# EAGLE design InfoAmazonia (EAGLE 7.3.0)
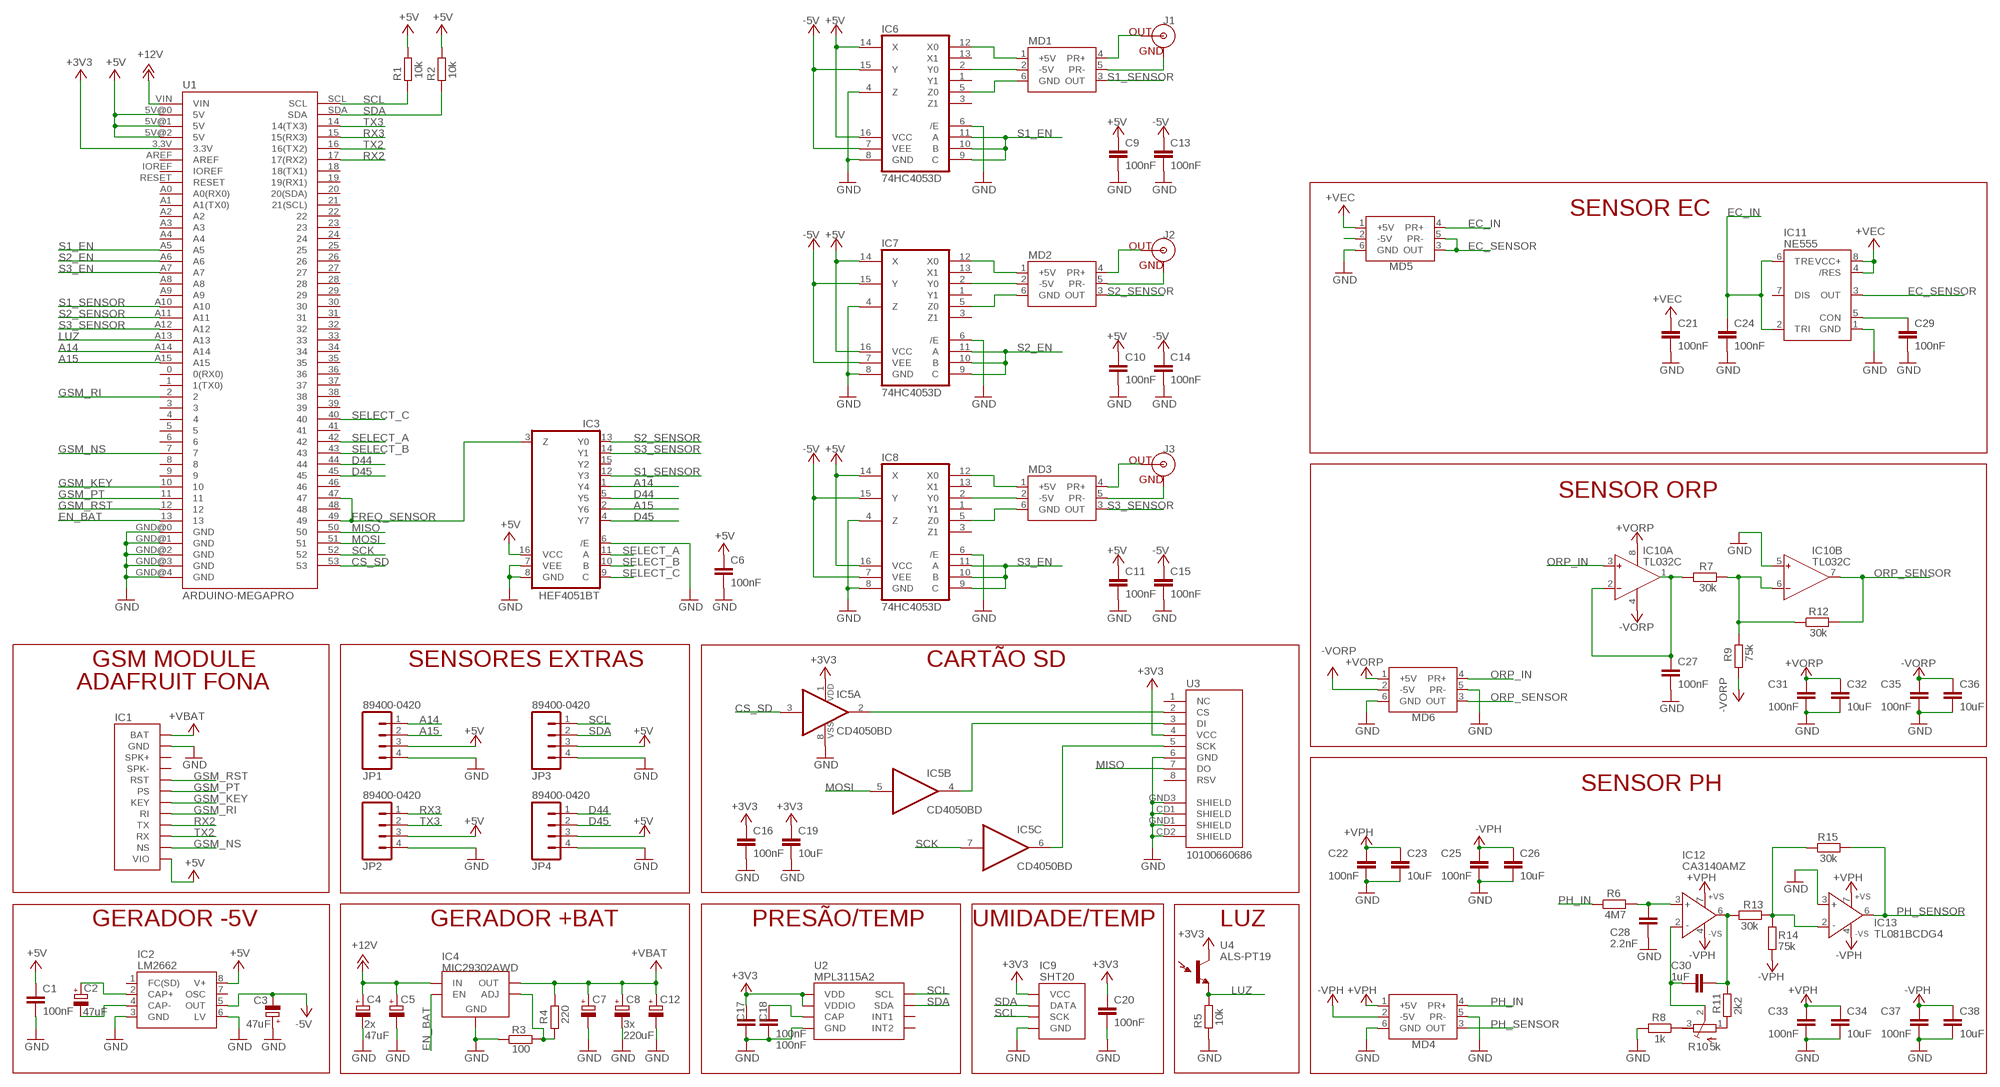
[diagram p0: schematic, sheet 1]

## Parts
C1  100nF  C-EUC0603  [C0603]
C2  47uF  CPOL-EUSMC_B  [SMC_B]
C3  47uF  CPOL-EUSMC_B  [SMC_B]
C4  47uF  CPOL-EUUD6,3-5,8  [UD-6,3X5,8_NICHICON]
C5  47uF  CPOL-EUUD6,3-5,8  [UD-6,3X5,8_NICHICON]
C6  100nF  C-EUC0603  [C0603]
C7  220uF  CPOL-EUUD6,3-5,8  [UD-6,3X5,8_NICHICON]
C8  220uF  CPOL-EUUD6,3-5,8  [UD-6,3X5,8_NICHICON]
C9  100nF  C-EUC0603  [C0603]
C10  100nF  C-EUC0603  [C0603]
C11  100nF  C-EUC0603  [C0603]
C12  220uF  CPOL-EUUD6,3-5,8  [UD-6,3X5,8_NICHICON]
C13  100nF  C-EUC0603  [C0603]
C14  100nF  C-EUC0603  [C0603]
C15  100nF  C-EUC0603  [C0603]
C16  100nF  C-EUC0603  [C0603]
C17  100nF  C-EUC0603  [C0603]
C18  100nF  C-EUC0603  [C0603]
C19  10uF  C-EUC0603  [C0603]
C20  100nF  C-EUC0603  [C0603]
C21  100nF  C-EUC0603  [C0603]
C22  100nF  C-EUC0603  [C0603]
C23  10uF  C-EUC0603  [C0603]
C24  100nF  C-EUC0603  [C0603]
C25  100nF  C-EUC0603  [C0603]
C26  10uF  C-EUC0603  [C0603]
C27  100nF  C-EUC0603  [C0603]
C28  2.2nF  C-EUC0603  [C0603]
C29  100nF  C-EUC0603  [C0603]
C30  1uF  C-EUC0603  [C0603]
C31  100nF  C-EUC0603  [C0603]
C32  10uF  C-EUC0603  [C0603]
C33  100nF  C-EUC0603  [C0603]
C34  10uF  C-EUC0603  [C0603]
C35  100nF  C-EUC0603  [C0603]
C36  10uF  C-EUC0603  [C0603]
C37  100nF  C-EUC0603  [C0603]
C38  10uF  C-EUC0603  [C0603]
IC1  ADAFRUIT FONA  ADAFRUIT_FONA  [ADAFRUIT_FONA]
IC2  LM2662  [SO8]
IC3  HEF4051BT  4051D  [SO16]
IC4  MIC29302AWD  MIC29XXX  [TO252-5]
IC5  CD4050BD  4050D  [SO16]
IC6  74HC4053D  4053D  [SO16]
IC7  74HC4053D  4053D  [SO16]
IC8  74HC4053D  4053D  [SO16]
IC9  SHT20  SHT2X  [SHT2X]
IC10  TL032C  AMPOP_2R  [SO8]
IC11  NE555  [SO8]
IC12  CA3140AMZ  AMPOP  [SO8]
IC13  TL081BCDG4  AMPOP  [SO8]
J1  31-5431-10RFX  BNCPTH  [BNC]
J2  31-5431-10RFX  BNCPTH  [BNC]
J3  31-5431-10RFX  BNCPTH  [BNC]
JP1  89400-0420  M04JST-PTH-VERT  [JST-4-PTH-VERT]
JP2  89400-0420  M04JST-PTH-VERT  [JST-4-PTH-VERT]
JP3  89400-0420  M04JST-PTH-VERT  [JST-4-PTH-VERT]
JP4  89400-0420  M04JST-PTH-VERT  [JST-4-PTH-VERT]
MD1  INFO-AMAZONIA-MODULE  [INFO-AMAZONIA-MODULE]
MD2  INFO-AMAZONIA-MODULE  [INFO-AMAZONIA-MODULE]
MD3  INFO-AMAZONIA-MODULE  [INFO-AMAZONIA-MODULE]
MD4  INFO-AMAZONIA-MODULE  [INFO-AMAZONIA-MODULE]
MD5  INFO-AMAZONIA-MODULE  [INFO-AMAZONIA-MODULE]
MD6  INFO-AMAZONIA-MODULE  [INFO-AMAZONIA-MODULE]
R1  10k  R-EU_R0603  [R0603]
R2  10k  R-EU_R0603  [R0603]
R3  100  R-EU_R0603  [R0603]
R4  220  R-EU_R0603  [R0603]
R5  10k  R-EU_R0603  [R0603]
R6  4M7  R-EU_R0603  [R0603]
R7  30k  R-EU_R0603  [R0603]
R8  1k  R-EU_R0603  [R0603]
R9  75k  R-EU_R0603  [R0603]
R10  5k  RTRIM329W  [RTRIM3296W]
R11  2k2  R-EU_R0603  [R0603]
R12  30k  R-EU_R0603  [R0603]
R13  30k  R-EU_R0603  [R0603]
R14  75k  R-EU_R0603  [R0603]
R15  30k  R-EU_R0603  [R0603]
U1  ARDUINO-MEGAPRO  [ARDUINO_MEGA_2560]
U2  MPL3115A2  MPL3115A2LGA8  [LGA8]
U3  10100660686  USD-SOCKETNEW  [MICRO-SD-SOCKET-PP]
U4  ALS-PT19  LIGHTSENSORALS  [ALS-PT19]

## Nets
+3V3: C16.1 C17.1 C19.1 C20.1 IC5.1(P:VDD) IC9.5(VCC) U1.3.3V U2.1(VDD) U2.4(VDDIO) U3.4(VCC) U4.C(C1)
+5V: C1.1 C6.1 C9.1 C10.1 C11.1 IC1.12(VIO) IC2.8(V+) IC3.16(VCC) IC6.14(X) IC6.16(VCC) IC7.14(X) IC7.16(VCC) IC8.14(X) IC8.16(VCC) JP1.3 JP2.3 JP3.3 JP4.3 R1.2 R2.2 U1.5V@0(5V) U1.5V@1(5V) U1.5V@2(5V)
+12V: C4.+ C5.+ IC4.2(IN) U1.VIN
+VBAT: C7.+ C8.+ C12.+ IC1.1(BAT) IC4.4(OUT) R4.1
+VEC: C21.1 IC11.4(/RES) IC11.8(VCC+) MD5.1(+5V)
+VORP: C31.1 C32.1 IC10.8(P:V+) MD6.1(+5V)
+VPH: C22.1 C23.1 C33.1 C34.1 IC12.7(+VS) IC13.7(+VS) MD4.1(+5V)
-5V: C3.- C13.1 C14.1 C15.1 IC2.5(OUT) IC6.7(VEE) IC6.15(Y) IC7.7(VEE) IC7.15(Y) IC8.7(VEE) IC8.15(Y)
-VORP: C35.1 C36.1 IC10.4(P:V-) MD6.2(-5V) R9.2
-VPH: C25.1 C26.1 C37.1 C38.1 IC12.4(-VS) IC13.4(-VS) MD4.2(-5V) R14.2
A14: IC3.1(Y4) JP1.1 U1.A14
A15: IC3.2(Y6) JP1.2 U1.A15
CS_SD: IC5.3(A:I) U1.53
D44: IC3.5(Y5) JP4.1 U1.44
D45: IC3.4(Y7) JP4.2 U1.45
EC_IN: C24.1 IC11.2(TRI) IC11.6(TRE) MD5.4(PR+)
EC_SENSOR: IC11.3(OUT) MD5.3(OUT) MD5.5(PR-)
EN_BAT: IC4.1(EN) U1.13
FREQ_SENSOR: IC3.3(Z) U1.47 U1.49
GND: C1.2 C3.+ C4.- C5.- C6.2 C7.- C8.- C9.2 C10.2 C11.2 C12.- C13.2 C14.2 C15.2 C16.2 C17.2 C18.2 C19.2 C20.2 C21.2 C22.2 C23.2 C24.2 C25.2 C26.2 C27.2 C28.2 C29.2 C31.2 C32.2 C33.2 C34.2 C35.2 C36.2 C37.2 C38.2 IC1.2(GND) IC1.K1(GND) IC1.K2(GND) IC2.3(GND) IC2.6(LV) IC3.6(/E) IC3.7(VEE) IC3.8(GND) IC4.3(GND) IC4.6(GND) IC5.8(P:VSS) IC6.4(Z) IC6.6(/E) IC6.8(GND) IC7.4(Z) IC7.6(/E) IC7.8(GND) IC8.4(Z) IC8.6(/E) IC8.8(GND) IC9.2(GND) IC9.7(GND) IC10.5(B:IN+) IC11.1(GND) IC13.3(IN+) JP1.4 JP2.4 JP3.4 JP4.4 MD4.5(PR-) MD4.6(GND) MD5.6(GND) MD6.5(PR-) MD6.6(GND) R3.1 R5.1 R8.2 U1.GND@0(GND) U1.GND@1(GND) U1.GND@2(GND) U1.GND@3(GND) U1.GND@4(GND) U2.3(GND) U3.6(GND) U3.CD1(SHIELD) U3.CD2(SHIELD) U3.GND1(SHIELD) U3.GND3(SHIELD)
GSM_KEY: IC1.7(KEY) U1.10
GSM_NS: IC1.11(NS) U1.7
GSM_PT: IC1.6(PS) U1.11
GSM_RI: IC1.8(RI) U1.2
GSM_RST: IC1.5(RST) U1.12
LUZ: R5.2 U1.A13 U4.E(E1)
MISO: U1.50 U3.7(DO)
MOSI: IC5.5(B:I) U1.51
N$1: J1.GND MD1.5(PR-)
N$2: C28.1 IC12.3(IN+) R6.2
N$3: C30.1 IC12.2(IN-) R10.2(S)
N$4: C30.2 IC12.6(OUT) R11.2 R13.2
N$5: IC13.2(IN-) R13.1 R14.1 R15.1
N$6: R8.1 R10.3(E)
N$7: C18.1 U2.2(CAP)
N$8: R10.1(A) R11.1
N$9: J1.S(OUT) MD1.4(PR+)
N$10: C29.1 IC11.5(CON)
N$11: J2.GND MD2.5(PR-)
N$12: J2.S(OUT) MD2.4(PR+)
N$13: J3.GND MD3.5(PR-)
N$14: C2.- IC2.4(CAP-)
N$15: C27.1 IC10.1(A:OUT) IC10.2(A:IN-) R7.2
N$16: C2.+ IC2.2(CAP+)
N$17: IC10.6(B:IN-) R7.1 R9.1 R12.1
N$18: IC4.5(ADJ) R3.2 R4.2
N$19: IC5.6(C:O) U3.5(SCK)
N$20: IC5.4(B:O) U3.3(DI)
N$21: IC5.2(A:O) U3.2(CS)
N$22: J3.S(OUT) MD3.4(PR+)
N$23: MD5.2(-5V)
N$24: IC6.12(X0) MD1.1(+5V)
N$25: IC6.2(Y0) MD1.2(-5V)
N$26: IC6.5(Z0) MD1.6(GND)
N$27: IC7.5(Z0) MD2.6(GND)
N$28: IC7.2(Y0) MD2.2(-5V)
N$29: IC7.12(X0) MD2.1(+5V)
N$30: IC8.12(X0) MD3.1(+5V)
N$31: IC8.2(Y0) MD3.2(-5V)
N$32: IC8.5(Z0) MD3.6(GND)
ORP_IN: IC10.3(A:IN+) MD6.4(PR+)
ORP_SENSOR: IC10.7(B:OUT) MD6.3(OUT) R12.2
PH_IN: MD4.4(PR+) R6.1
PH_SENSOR: IC13.6(OUT) MD4.3(OUT) R15.2
RX2: IC1.9(TX) U1.17(17(RX2))
RX3: JP2.1 U1.15(15(RX3))
S1_EN: IC6.9(C) IC6.10(B) IC6.11(A) U1.A5
S1_SENSOR: IC3.12(Y3) MD1.3(OUT) U1.A10
S2_EN: IC7.9(C) IC7.10(B) IC7.11(A) U1.A6
S2_SENSOR: IC3.13(Y0) MD2.3(OUT) U1.A11
S3_EN: IC8.9(C) IC8.10(B) IC8.11(A) U1.A7
S3_SENSOR: IC3.14(Y1) MD3.3(OUT) U1.A12
SCK: IC5.7(C:I) U1.52
SCL: IC9.6(SCK) JP3.1 R1.1 U1.SCL U2.8(SCL)
SDA: IC9.1(DATA) JP3.2 R2.1 U1.SDA U2.7(SDA)
SELECT_A: IC3.11(A) U1.42
SELECT_B: IC3.10(B) U1.43
SELECT_C: IC3.9(C) U1.40
TX2: IC1.10(RX) U1.16(16(TX2))
TX3: JP2.2 U1.14(14(TX3))
Unconnected: IC1.3(SPK+) IC1.4(SPK-) IC2.7(OSC) IC3.15(Y2) IC5.9(D:I) IC5.10(D:O) IC5.11(E:I) IC5.12(E:O) IC5.14(F:I) IC5.15(F:O) IC6.1(Y1) IC6.3(Z1) IC6.13(X1) IC7.1(Y1) IC7.3(Z1) IC7.13(X1) IC8.1(Y1) IC8.3(Z1) IC8.13(X1) IC11.7(DIS) U1.0(0(RX0)) U1.1(1(TX0)) U1.3 U1.4 U1.5 U1.6 U1.8 U1.9 U1.18(18(TX1)) U1.19(19(RX1)) U1.20(20(SDA)) U1.21(21(SCL)) U1.22 U1.23 U1.24 U1.25 U1.26 U1.27 U1.28 U1.29 U1.30 U1.31 U1.32 U1.33 U1.34 U1.35 U1.36 U1.37 U1.38 U1.39 U1.41 U1.46 U1.48 U1.A0(A0(RX0)) U1.A1(A1(TX0)) U1.A2 U1.A3 U1.A4 U1.A8 U1.A9 U1.AREF U1.IOREF U1.RESET U2.5(INT2) U2.6(INT1) U3.1(NC) U3.8(RSV)

## Notes on the sheet
- SENSOR EC
- SENSOR ORP
- GSM MODULE | SENSORES EXTRAS | CARTÃO SD
- ADAFRUIT FONA
- SENSOR PH
- GERADOR -5V | GERADOR +BAT | PRESÃO/TEMP | UMIDADE/TEMP | LUZ
- 2x | 3x

## Power pins joined to a net without a drawn wire
FC(SD): IC2.1(FC(SD))

## Library data of the parts
C1 C6 C9-C11 C13-C38 = InfoAmazonia:C-EU: CAPACITOR, European symbol
C2-C5 C7 C8 C12 = InfoAmazonia:CPOL-EU: POLARIZED CAPACITOR, European symbol
IC1 = InfoAmazonia:ADAFRUIT_FONA
IC2 = InfoAmazonia:LM2662
IC3 = InfoAmazonia:4051: 8-channel ANALOG MULTIPLEXER
IC4 = InfoAmazonia:MIC29XXX
IC5 = InfoAmazonia:4050: Hex non-inverting BUFFER
IC6-IC8 = InfoAmazonia:4053: Triple 2-channel ANALOG MULTIPLEXER
IC9 = InfoAmazonia:SHT2X
IC10 = InfoAmazonia:AMPOP_2: Dual Precision, Low Cost, High Speed BiFET Op Amp Source: http://www.analog.com/static/imported-files/data_sheets/AD712.pdf; MF: ALTERA CORPORATION; MPN: AD712KRZ; OC_FARNELL: 1263975; OC_NEWARK: 59K4556
IC11 = InfoAmazonia:NE555: General purpose bipolar Timer
IC12 IC13 = InfoAmazonia:AMPOP: High Performance Video Op Amp Source: http://www.analog.com/static/imported-files/data_sheets/AD811.pdf; MF: ALTERA CORPORATION; MPN: AD811JRZ; OC_FARNELL: 9426485; OC_NEWARK: 82H2980
J1-J3 = InfoAmazonia:BNC: BNC Connector, Mouser Part# 5227161
JP1-JP4 = InfoAmazonia:M04: Header 4 Standard 4-pin 0.1" header. Use with straight break away headers (SKU : PRT-00116), right angle break away headers (PRT-00553), swiss pins (PRT-00743), machine pins (PRT-00117), and female headers (PRT-00115). Molex polarized connector foot print use with SKU : PRT-08231 with associated crimp pins and housings. 1MM SMD Version SKU: PRT-10208
MD1-MD6 = InfoAmazonia:INFO-AMAZONIA-MODULE
R1-R9 R11-R15 = InfoAmazonia:R-EU_: RESISTOR, European symbol
R10 = InfoAmazonia:RTRIM329: Trimm resistor
U1 = InfoAmazonia:ARDUINO-MEGA: Arduino Mega board footprint
U2 = InfoAmazonia:MPL3115A2: Altimeter/Pressure Sensor, I2C, 1.95V-3.6V supply, 50 to 110kPa; PROD_ID: IC-10869
U3 = InfoAmazonia:USD-SOCKET: microSD Socket Push-push type uSD socket. Schematic element and footprint production proven. Spark Fun Electronics SKU : PRT-00127. tDoc lines correctly indicate media card edge positions when inserting (unlocked, locked, depressed).
U4 = InfoAmazonia:LIGHTSENSOR: Ambient Light Sensor Simple light detection sensor. Output varies with light intensity input. Spark Fun Electronics SKU : COM-08348; PROD_ID: IC-11836

## Board
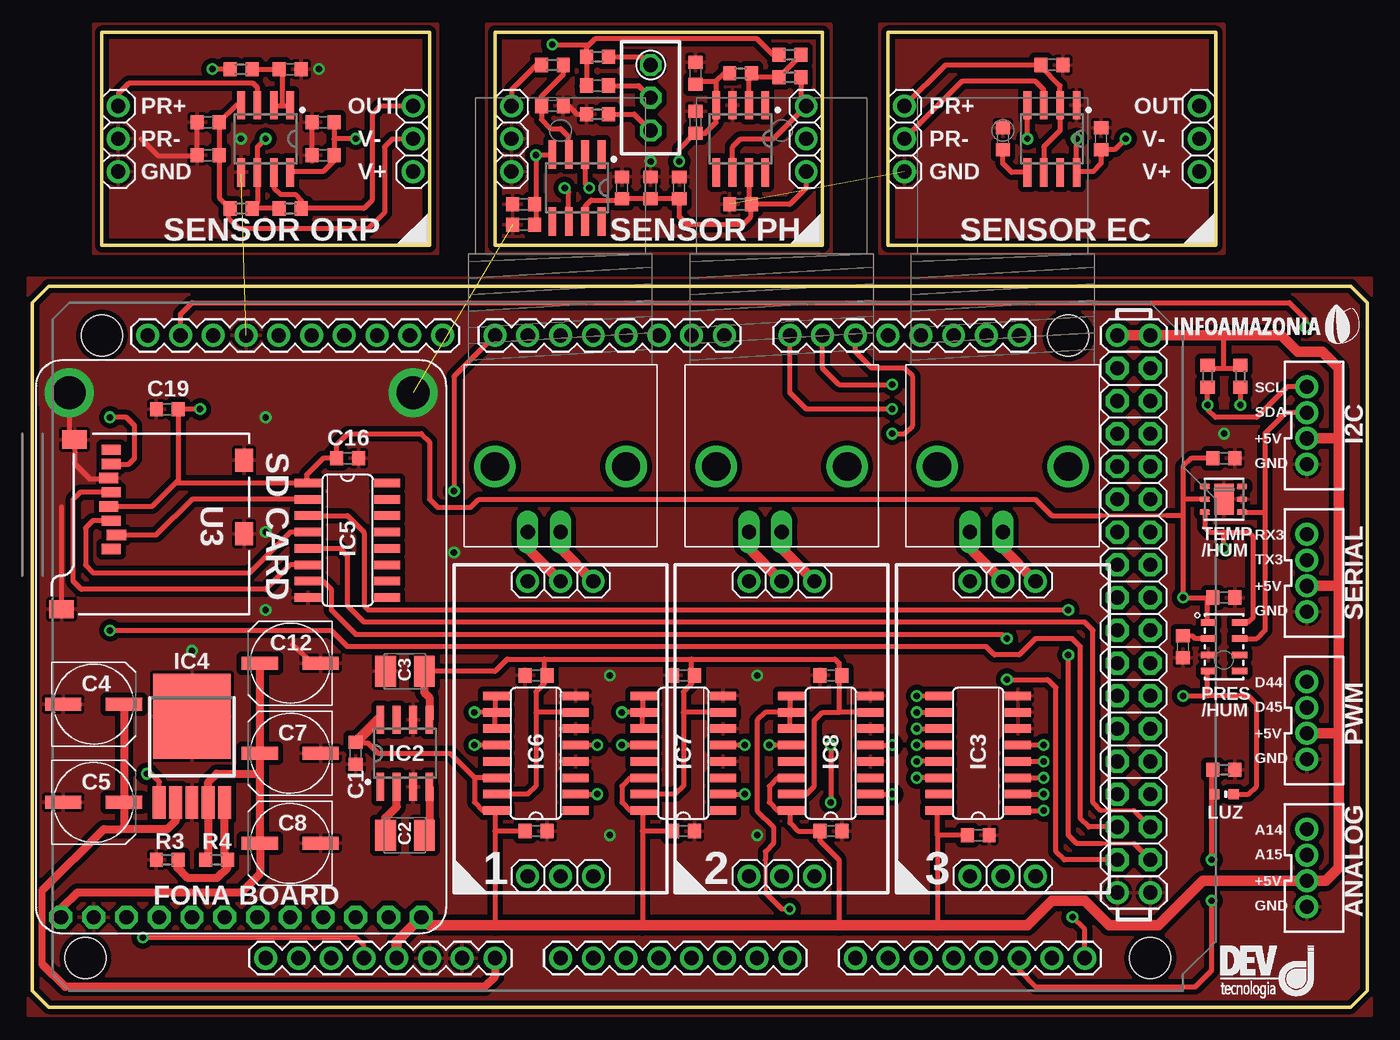
[diagram p1: board, top side]
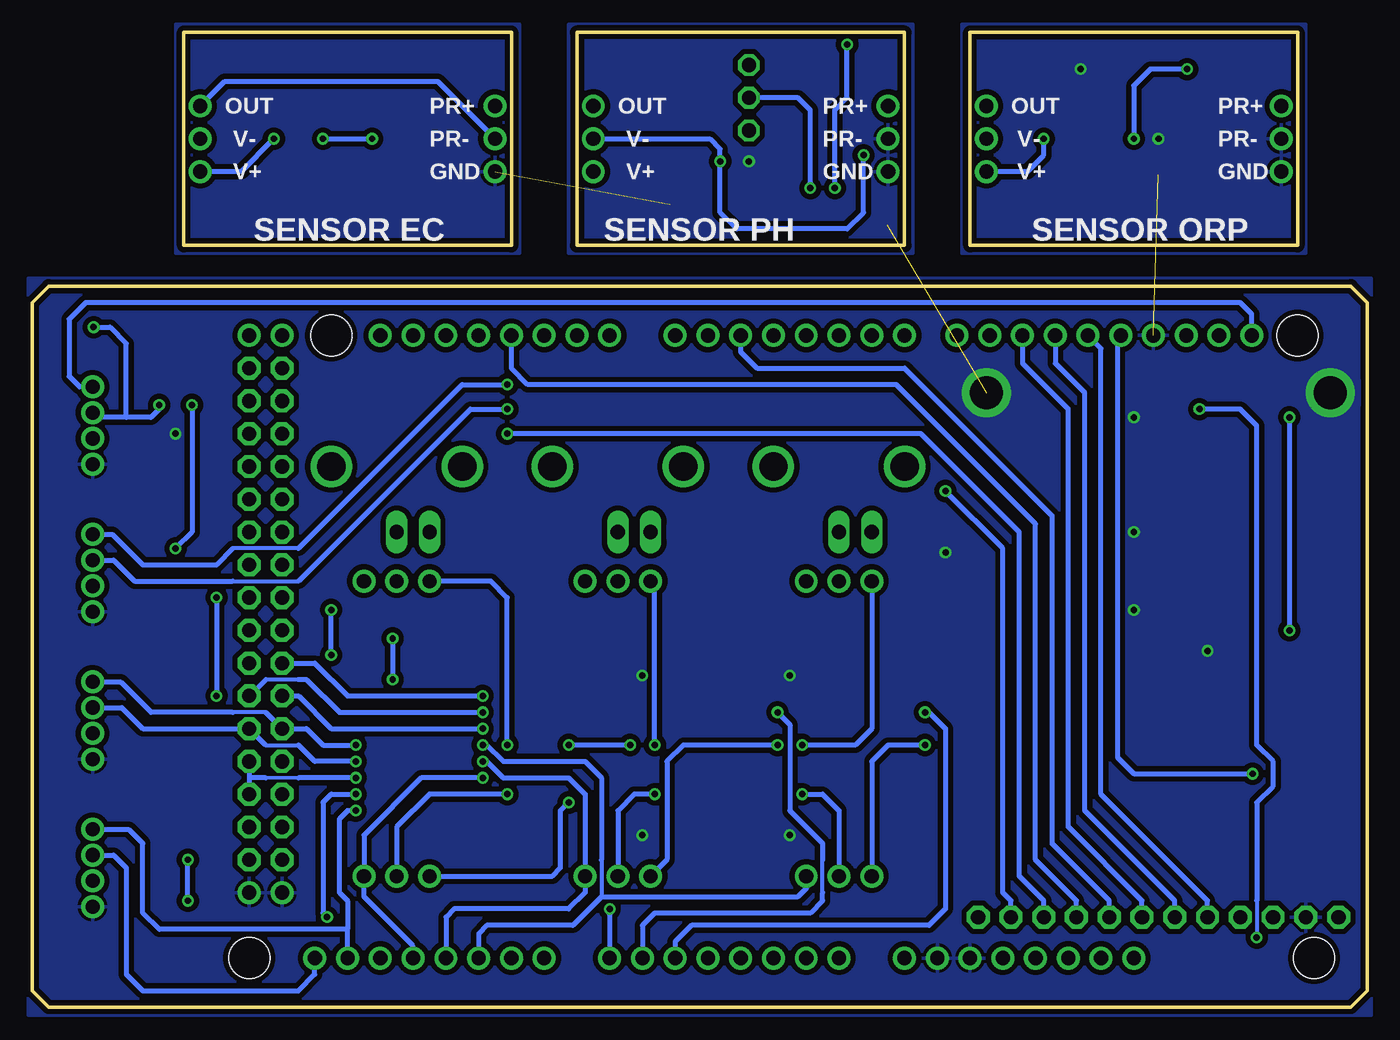
[diagram p2: board, bottom side, seen from below]

Size 103.5 x 75.56 mm. Coordinates in mm from the lower left corner, seen from the top.
Outline: 5.4,59.05 30.8,59.05 30.8,75.56 5.4,75.56 5.4,59.05
Outline: 61.28,59.05 35.88,59.05 35.88,75.56 61.28,75.56 61.28,59.05
Outline: 66.36,59.05 91.76,59.05 91.76,75.56 66.36,75.56 66.36,59.05
Outline: 0,54.61 0,1.27 1.27,0 102.24,0 103.51,1.27 103.51,54.61 102.24,55.88 1.27,55.88 0,54.61
Copper layers (1*16): Top 0.035mm / dielectric 1.5mm / Bottom 0.035mm
Design rules "default *": minimum track width 8mil, minimum drill 0.4mm, track to track 8mil, track to pad 8mil, pad to pad 8mil, via to via 8mil, smd to smd 8mil, copper to edge 5mil, drill to drill 8mil, minimum pad ring 10mil, minimum via ring 8mil, stop-mask expansion 4mil, vias tented up to drill 20mil, thermal gap 10mil

### Footprints (pad centres in the part's own frame; a part is rotated, then mirrored left to right if it is on the bottom)
C0603 = smd 1 x 1.1: 1 -0.85,0; 2 0.85,0
SMC_B = smd 1.6 x 2.4: + -1.5,0; - 1.5,0
UD-6,3X5,8_NICHICON = smd 2.8 x 1: + 2.35,0; - -2.35,0
ADAFRUIT_FONA = drill 1.1 pad 1.778 octagon: 1 -13.97,1.27; 2 -11.43,1.27; 3 -8.89,1.27; 4 -6.35,1.27; 5 -3.81,1.27; 6 -1.27,1.27; 7 1.27,1.27; 8 3.81,1.27; 9 6.35,1.27; 10 8.89,1.27; 11 11.43,1.27; 12 13.97,1.27 | drill 2.54 pad 3.81: K1 -13.335,41.91; K2 13.335,41.91
SO8 = smd 0.6 x 2.2: 1 -1.905,-2.6; 2 -0.635,-2.6; 3 0.635,-2.6; 4 1.905,-2.6; 5 1.905,2.6; 6 0.635,2.6; 7 -0.635,2.6; 8 -1.905,2.6
SO16 = smd 0.66 x 2.032: 1 -4.445,-3.073; 2 -3.175,-3.073; 3 -1.905,-3.073; 4 -0.635,-3.073; 5 0.635,-3.073; 6 1.905,-3.073; 7 3.175,-3.073; 8 4.445,-3.073; 9 4.445,3.073; 10 3.175,3.073; 11 1.905,3.073; 12 0.635,3.073; 13 -0.635,3.073; 14 -1.905,3.073; 15 -3.175,3.073; 16 -4.445,3.073
TO252-5 = smd 1 x 2.5: 1 -2.54,-6.35; 2 -1.27,-6.35; 3 0,-6.35; 4 1.27,-6.35; 5 2.54,-6.35 | smd 6 x 6.6: 6 0,0.318
SHT2X = smd 0.4 x 0.8: 1 -1,-1.4; 2 0,-1.4; 3 1,-1.4; 4 1,1.5; 5 0,1.5; 6 -1,1.5 | smd 2.4 x 1.5: 7 0,0
BNC = drill 2.2: 3 -5.08,5.08; 4 5.08,5.08 | drill 1.1 long: GND -2.54,0; S 0,0
JST-4-PTH-VERT = drill 1.1 pad 1.778: 1 -3,-0.55; 2 -1,-0.55; 3 1,-0.55; 4 3,-0.55
INFO-AMAZONIA-MODULE = drill 1.1 pad 1.778: 1 11.43,-2.54; 2 11.43,0; 3 11.43,2.54; 4 -11.43,2.54; 5 -11.43,0; 6 -11.43,-2.54
R0603 = smd 1 x 1.1: 1 -0.85,0; 2 0.85,0
RTRIM3296W = drill 1.1 pad 1.676 octagon: 1 0,-2.54; 2 0,0; 3 0,2.54
ARDUINO_MEGA_2560 = drill 1.1 pad 1.778: 0 52.07,50.8; 1 49.53,50.8; 2 46.99,50.8; 3 44.45,50.8; 3.3V 24.13,2.54; 4 41.91,50.8; 5 39.37,50.8; 5V@0 26.67,2.54; 5V@1 82.55,50.8; 5V@2 85.09,50.8; 6 36.83,50.8; 7 34.29,50.8; 8 30.226,50.8; 9 27.686,50.8; 10 25.146,50.8; 11 22.606,50.8; 12 20.066,50.8; 13 17.526,50.8; 14 57.15,50.8; 15 59.69,50.8; 16 62.23,50.8; 17 64.77,50.8; 18 67.31,50.8; 19 69.85,50.8; 20 72.39,50.8; 21 74.93,50.8; A0 39.37,2.54; A1 41.91,2.54; A2 44.45,2.54; A3 46.99,2.54; A4 49.53,2.54; A5 52.07,2.54; A6 54.61,2.54; A7 57.15,2.54; A8 62.23,2.54; A9 64.77,2.54; A10 67.31,2.54; A11 69.85,2.54; A12 72.39,2.54; A13 74.93,2.54; A14 77.47,2.54; A15 80.01,2.54; AREF 12.446,50.8; GND@0 29.21,2.54; GND@1 31.75,2.54; GND@2 82.55,7.62; GND@3 85.09,7.62; GND@4 14.986,50.8; IOREF 19.05,2.54; NC 16.51,2.54; RESET 21.59,2.54; SCL 7.366,50.8; SDA 9.906,50.8; VIN 34.29,2.54 | drill 1.1 pad 1.778 octagon: 22 82.55,48.26; 23 85.09,48.26; 24 82.55,45.72; 25 85.09,45.72; 26 82.55,43.18; 27 85.09,43.18; 28 82.55,40.64; 29 85.09,40.64; 30 82.55,38.1; 31 85.09,38.1; 32 82.55,35.56; 33 85.09,35.56; 34 82.55,33.02; 35 85.09,33.02; 36 82.55,30.48; 37 85.09,30.48; 38 82.55,27.94; 39 85.09,27.94; 40 82.55,25.4; 41 85.09,25.4; 42 82.55,22.86; 43 85.09,22.86; 44 82.55,20.32; 45 85.09,20.32; 46 82.55,17.78; 47 85.09,17.78; 48 82.55,15.24; 49 85.09,15.24; 50 82.55,12.7; 51 85.09,12.7; 52 82.55,10.16; 53 85.09,10.16 | hole 3.2: 3.81,50.8; 2.54,2.54; 78.74,50.8; 85.09,2.54
LGA8 = smd 1.2 x 0.5: 1 -1.2,1.875; 2 -1.2,0.625; 3 -1.2,-0.625; 4 -1.2,-1.875; 5 1.2,-1.875; 6 1.2,-0.625; 7 1.2,0.625; 8 1.2,1.875
MICRO-SD-SOCKET-PP = smd 0.8 x 1.5: 1 -8.94,10.7; 2 -7.84,10.3; 3 -6.74,10.7; 4 -5.64,10.9; 5 -4.54,10.7; 6 -3.44,10.9; 7 -2.34,10.7; 8 -1.24,10.7 | smd 1.8 x 1.4: CD1 -2.05,0.4; CD2 -7.75,0.4 | smd 1.4 x 1.9: GND1 -13.6,14.55; GND3 -0.45,13.55
ALS-PT19 = smd 0.8 x 0.8: C -0.75,0; E 0.75,0

### Placement (x,y rotation side)
C1  25.08,19.68 270 top
C2  28.89,13.33 0 top
C3  28.89,26.04 0 top
C4  4.76,23.5 0 top
C5  4.76,15.88 0 top
C6  73.34,13.33 0 top
C7  20,19.68 180 top
C8  20,12.7 180 top
C9  39.05,13.65 0 top
C10  50.48,13.65 0 top
C11  61.91,13.65 0 top
C12  20,26.67 180 top
C13  39.05,25.72 180 top
C14  50.48,25.72 180 top
C15  61.91,25.72 180 top
C16  24.45,42.55 0 top
C17  92.39,31.75 0 top
C18  89.22,27.94 270 top
C19  10.48,46.36 180 top
C20  92.39,42.55 0 top
C21  82.87,67.31 90 top
C22  45.72,63.5 90 top
C23  47.94,63.5 90 top
C24  79.06,73.02 0 top
C25  38.1,62.23 180 top
C26  38.1,60.64 180 top
C27  20,72.71 0 top
C28  40.32,69.85 0 top
C29  75.25,67.31 90 top
C30  43.82,71.44 180 top
C31  22.54,66.04 180 top
C32  22.54,68.58 180 top
C33  54.93,62.23 180 top
C34  50.16,63.5 90 top
C35  13.65,66.04 180 top
C36  13.65,68.58 180 top
C37  51.44,68.58 90 top
C38  51.44,72.39 90 top
IC1  16.19,5.71 0 top
IC2  28.89,19.68 0 top
IC3  73.34,19.68 90 top
IC4  12.38,22.22 0 top
IC5  24.45,36.2 270 top
IC6  39.05,19.68 90 top
IC7  50.48,19.68 90 top
IC8  61.91,19.68 90 top
IC9  92.39,39.37 90 top
IC10  18.1,67.31 180 top
IC11  79.06,67.31 180 top
IC12  42.23,63.5 180 top
IC13  54.93,67.31 180 top
J1  40.96,36.83 0 top
J2  58.1,36.83 0 top
J3  75.25,36.83 0 top
JP1  99.38,10.79 270 top
JP2  99.38,33.66 270 top
JP3  99.38,45.09 270 top
JP4  99.38,22.22 270 top
MD1  40.96,21.59 270 top
MD2  58.1,21.59 270 top
MD3  75.25,21.59 270 top
MD4  48.58,67.31 0 top
MD5  79.06,67.31 0 top
MD6  18.1,67.31 0 top
R1  91.12,48.9 90 top
R2  93.66,48.9 90 top
R3  10.48,11.43 0 top
R4  14.29,11.43 0 top
R5  92.39,18.41 180 top
R6  40.32,73.02 0 top
R7  16.19,72.71 0 top
R8  43.82,69.21 180 top
R9  16.19,61.91 180 top
R10  47.94,70.48 180 top
R11  43.82,73.66 180 top
R12  20,61.91 0 top
R13  58.74,73.82 180 top
R14  54.93,72.39 180 top
R15  58.74,72.07 0 top
U1  1.59,1.27 0 top
U2  92.39,27.94 0 top
U3  16.83,44.45 90 top
U4  92.39,16.51 180 top
U$1  [LOGO-INFO-0.38]  88.58,51.44 0 top
U$2  [LOGO-DEV-0.9]  92.07,0.64 0 top

### Tracks (layer width: path | path; a pad name or v marks a point on that pad's centre or on a via)
+3V3  (via drill 0.5)
  Top 0.305: 87.95,38.1 82.87,38.1
  Top 0.406: U3.4 9.28,38.81 11.11,40.64 | 11.11,40.64 11.33,40.86 C19.1 v13.02,46.36 | 11.11,40.64 IC5.1 21.27,40.74 21.27,41.28 22.54,42.55 C16.1 23.6,43.6 24.45,44.45 30.16,44.45 30.8,43.82 30.8,39.37 31.43,38.74 33.97,38.74 34.61,39.37 77.79,39.37 79.06,38.1 82.87,38.1 | 91.12,24.13 91.12,26 U2.4 | IC9.5 89.22,39.37 | 89.22,39.37 89.22,38.1 | 89.22,38.1 v89.22,31.75 91.12,31.75 | 91.12,29.84 91.15,29.82 U2.1 91.12,29.82 91.12,29.84 | 91.12,29.84 91.12,31.75 | 91.12,31.75 C17.1 | C20.1 89.85,42.55 89.22,41.91 89.22,39.37 | v89.22,24.13 91.12,24.13 | U1.3.3V 25.72,4.76 25.08,5.4 v8.57,5.4 | 89.22,38.1 87.95,38.1 | U4.C 94.3,16.51 94.93,17.14 94.93,23.5 94.3,24.13 91.12,24.13
  Bottom 0.305: 8.57,8.26 v8.57,5.4
  Bottom 0.406: v89.22,31.75 v89.22,24.13 | v13.02,46.36 9.84,46.36 8.57,45.09 8.57,20.32 7.3,19.05 7.3,17.14 8.57,15.88 8.57,8.26
+5V
  Top 0.305: 35.88,15.14 IC6.16
  Top 0.406: IC2.8 26.83,22.29 | 25.14,20.48 26.04,20.48 26.83,19.68 32.39,19.68 34.29,17.78 | C6.1 70.17,13.33 | 70.17,13.33 70.17,15.14 | 70.17,15.14 IC3.16 | 70.17,15.14 70.17,15.24 | IC6.14 34.29,17.78 | 34.29,17.78 34.29,15.88 34.93,15.24 IC6.16 | 35.88,15.14 35.88,13.65 | 35.88,13.65 35.88,6.35 | C9.1 35.88,13.65 | IC7.14 46.36,17.78 45.72,17.14 45.72,15.88 46.36,15.24 47.31,15.24 | IC7.16 47.31,15.24 | 47.31,15.24 47.31,13.65 | 47.31,13.65 47.31,6.35 | C10.1 47.31,13.65 | IC8.14 57.79,17.78 57.15,17.14 57.15,15.88 57.79,15.24 58.74,15.24 | IC8.16 58.74,15.24 | 58.74,15.24 58.74,14.29 59.37,13.65 C11.1 61.06,12.91 62.55,11.43 62.55,6.35 | 70.17,13.33 70.17,6.35 | 91.34,49.53 R1.2 91.12,49.53 91.34,49.53 | 91.34,49.53 92.39,49.53 | 92.39,49.53 93.45,49.53 arc90 R2.2 | 92.39,49.53 92.39,52.07
  Top 0.813: 26.83,22.29 C1.1 25.14,20.48 | U1.5V@1 U1.5V@2 92.39,52.07 96.84,52.07 98.11,50.8 100.01,50.8 101.28,49.53 101.28,44.09 | U1.5V@0 28.26,5.08 IC1.12 30.8,6.35 35.88,6.35 47.31,6.35 62.55,6.35 70.17,6.35 77.15,6.35 79.06,8.26 81.6,8.26 83.5,6.35 87.31,6.35 90.76,9.79 JP1.3 100.28,9.79 101.28,10.79 101.28,20.95 | 101.28,44.09 101.28,32.38 | 101.28,32.38 101.28,20.95 | JP3.3 101.28,44.09 | JP4.3 101.01,21.22 101.28,20.95 | JP2.3 101.01,32.66 101.28,32.38
+12V
  Top 0.559: 0.79,3.33 0.79,9.05
  Top 0.61: U1.VIN 35.88,2.38 35.08,1.59 2.54,1.59 0.79,3.33 | 0.79,9.05 5.56,13.81 6.95,13.81 | C4.+ C5.+ 7.11,13.97 | IC4.2 11.11,14.45 10.48,13.81 6.95,13.81 | 7.11,13.97 7.11,13.84 | 6.95,13.81 7.11,13.97
+VBAT
  Top 0.406: 17.62,19.05 17.62,19.65 C7.+
  Top 0.61: 17.65,18.1 14.29,18.1 13.65,17.46 IC4.4 13.65,11.64 R4.1 | 17.65,18.1 C8.+ 17.65,10.35 16.19,8.89 3.49,8.89 2.22,7.62 IC1.1 | 17.65,18.1 C7.+ C12.+
+VEC  (via drill 0.5)
  Top 0.406: v84.77,67.31 83.92,66.46 C21.1 82.87,65.41 82.23,64.77 81.02,64.77 IC11.8 v80.96,67.31 | v77.15,67.31 IC11.4
  Bottom 0.406: v84.77,67.31 87.31,64.77 MD5.1 | v80.96,67.31 v77.15,67.31
+VORP  (via drill 0.5)
  Top 0.406: v25.08,67.31 23.39,67.31 | C32.1 23.39,67.31 | 23.39,67.31 C31.1 23.39,65.62 22.54,64.77 20.06,64.77 IC10.8
  Bottom 0.406: v25.08,67.31 25.08,66.04 26.35,64.77 MD6.1
+VPH
  Top 0.406: C33.1 58.74,62.23 60.01,63.5 MD4.1 | IC12.7 42.86,62.07 43.34,62.55 45.19,62.55 C22.1 C23.1 C34.1 50.16,61.28 50.8,60.64 55.09,60.64 55.72,61.28 55.72,62.17 C33.1 | IC13.7 55.56,62.45 C33.1
-5V
  Top 0.305: C13.1 39.69,26.04 | IC2.5 30.8,24.13 30.48,24.29 30.48,26.67 30.8,26.67 30.8,26.99 | C14.1 51.12,26.04 | 62.55,26.04 C15.1 62.55,26.25
  Top 0.406: 39.05,22.86 39.05,17.14 38.42,16.51 IC6.15 | IC6.7 39.05,22.86 | 50.48,22.86 50.48,17.14 49.85,16.51 IC7.15 | IC7.7 50.48,22.86 | 62.55,26.04 62.55,22.86 | IC8.7 62.55,22.86 | 39.69,26.99 36.83,26.99 35.88,26.04 C3.- | 39.69,26.99 51.12,26.99 | 51.12,26.99 62.23,26.99 62.55,26.67 62.55,26.25 | 51.12,26.99 51.12,26.04 51.12,25.08 50.48,24.45 50.48,22.86 | IC8.15 60.01,16.51 60.64,17.14 60.64,22.22 61.28,22.86 62.55,22.86 | 39.69,26.99 39.69,26.25 C13.1 | 39.69,26.04 39.69,25.08 39.05,24.45 39.05,22.86
  Top 0.61: C3.- 30.39,24.38 30.48,24.29 30.8,23.97 IC2.5
-VORP
  Top 0.406: IC10.4 15.83,69.91 C36.1 C35.1 14.5,62.75 R9.2 15.24,61.81 15.24,61.12 16.03,60.33 26.04,60.33 27.31,61.6 27.31,66.67 27.94,67.31 MD6.2
-VPH  (via drill 0.5)
  Top 0.406: R14.2 53.66,72.39 53.02,71.75 | 53.02,71.75 IC13.4 53.02,68.58 52.17,67.73 C37.1 51.38,67.73 50.16,66.52 v50.16,65.56 | C38.1 51.54,71.54 51.75,71.75 53.02,71.75 | IC12.4 arc-90 40.26,66.04 v39.05,66.04 39.05,62.23 | 39.05,62.23 39.05,60.64 C26.1 | C25.1 39.05,62.23
  Bottom 0.406: v39.05,66.04 39.05,61.6 40.32,60.33 48.9,60.33 50.16,61.6 v50.16,65.56 50.16,66.52 50.96,67.31 MD4.2
A14  (via drill 0.5)
  Top 0.406: IC3.1 v78.42,15.24
  Bottom 0.406: 79.06,6.03 93.66,6.03 94.93,7.3 94.93,12.7 96.03,13.79 JP1.1 | U1.A14 79.06,6.03 | 79.06,6.03 79.06,8.26 79.69,8.89 79.69,14.61 79.06,15.24 v78.42,15.24
A15  (via drill 0.5)
  Top 0.406: U1.A15 81.6,6.03 v80.65,6.98 | IC3.2 v78.42,16.51
  Bottom 0.406: JP1.2 97.2,11.79 96.2,10.79 96.2,2.54 94.93,1.27 82.87,1.27 81.6,2.54 U1.A15 | v80.65,6.98 80.96,7.3 80.96,15.88 80.33,16.51 v78.42,16.51
CS_SD  (via drill 0.5)
  Top 0.305: 82.87,12.7 85.41,12.7
  Top 0.406: U1.53 85.41,12.7 | v80.33,27.3 80.33,13.33 80.96,12.7 82.87,12.7 | IC5.3 24.45,38.1 25.72,36.83 25.72,31.11 26.04,30.8 v80.33,30.8
  Bottom 0.406: v80.33,27.3 v80.33,30.8
D44  (via drill 0.5)
  Top 0.406: v78.42,20.32 IC3.5
  Bottom 0.305: 85.41,22.86 87.95,22.86
  Bottom 0.406: JP4.1 96.66,25.22 94.3,22.86 87.95,22.86 | 85.41,22.86 U1.44 82.23,21.59 80.96,20.32 v78.42,20.32
D45  (via drill 0.5)
  Top 0.406: IC3.4 v78.42,19.05
  Bottom 0.305: 85.41,20.32 82.87,20.32
  Bottom 0.406: JP4.2 96.57,23.22 94.93,21.59 U1.45 85.41,20.32 | v78.42,19.05 81.6,19.05 82.87,20.32
EC_IN
  Top 0.406: IC11.6 78.42,66.67 79.69,67.94 IC11.2 79.69,71.44 78.21,72.92 C24.1 70.8,73.02 MD5.4
EC_SENSOR
  Top 0.406: IC11.3 78.42,71.12 77.79,71.75 72.07,71.75 MD5.5
  Bottom 0.406: MD5.3 88.58,71.75 72.07,71.75 MD5.5
EN_BAT  (via drill 0.5)
  Top 0.406: IC4.1 9.84,17.46 9.21,18.1 v8.89,18.1
  Bottom 0.406: U1.13 19.37,51.82 19.37,19.37 18.1,18.1 v8.89,18.1
FREQ_SENSOR  (via drill 0.5)
  Top 0.406: IC3.3 v78.42,17.78
  Bottom 0.254: 82.87,17.78 85.41,17.78
  Bottom 0.406: U1.47 86.68,17.78 | 86.68,17.78 U1.49 | v78.42,17.78 82.87,17.78 | 85.41,17.78 86.68,17.78
GND  (via drill 0.5)  (3 unrouted)
  Top 0.406: 8.45,67.31 9.75,66.01 12.77,66.01 C35.2 | C35.2 C36.2 | C31.2 C32.2 | IC10.5 16.19,64.52 | 12.76,66 C35.2 | C21.2 82.71,68.16 | 75.18,68.23 C29.2 | IC1.K1 2.86,44.42 U3.GND3 3.28,42.12 4.45,40.96 5.88,40.96 U3.6 | U3.GND1 2.28,38.79 | 9.68,46.41 C19.2 | C12.- 21.75,26.67 20.16,28.1 | 16.41,42.39 U3.CD1 | C28.2 41.59,69.85 42.23,69.21 R8.2
  other vias: 18.1,36.83 16.19,67.31 22.22,72.71 47.94,65.56 18.1,45.72 18.1,30.8 12.38,27.62 44.77,13.33 56.2,13.33 56.2,25.72 44.77,25.72 92.39,44.45 32.7,35.24
  pour Top (isolate 0.406): -0.32,-0.64 103.82,-0.64 103.82,56.52 -0.32,56.52
  pour Bottom (isolate 0.406): -0.32,-0.64 103.82,-0.64 103.82,56.52 -0.32,56.52
  pour Top (isolate 0.406): 65.72,76.2 65.72,58.42 92.39,58.42 92.39,76.2
  pour Bottom (isolate 0.406): 65.72,76.2 65.72,58.42 92.39,58.42 92.39,76.2
  pour Bottom (isolate 0.406): 35.24,76.2 35.24,58.42 61.91,58.42 61.91,76.2
  pour Top (isolate 0.406): 35.24,76.2 35.24,58.42 61.91,58.42 61.91,76.2
  pour Top (isolate 0.406): 4.76,76.2 4.76,58.42 31.43,58.42 31.43,76.2
  pour Bottom (isolate 0.406): 4.76,76.2 4.76,58.42 31.43,58.42 31.43,76.2
  pour Bottom (no thermals): 1.9,49.85 0.64,48.58 0.64,46.67 1.9,45.4 3.81,45.4 5.08,46.67 5.08,48.58 3.81,49.85
  pour Bottom (no thermals): 28.57,49.85 27.3,48.58 27.3,46.67 28.57,45.4 30.48,45.4 31.75,46.67 31.75,48.58 30.48,49.85
  pour Top (no thermals): 28.57,49.85 27.3,48.58 27.3,46.67 28.57,45.4 30.48,45.4 31.75,46.67 31.75,48.58 30.48,49.85
  pour Top (no thermals): 1.9,49.85 0.64,48.58 0.64,46.67 1.9,45.4 3.81,45.4 5.08,46.67 5.08,48.58 3.81,49.85
GSM_KEY
  Bottom 0.406: IC1.7 17.46,8.26 23.18,13.97 23.18,46.36 26.73,49.91 U1.10
GSM_NS  (via drill 0.5)
  Top 0.406: U1.7 32.7,48.9 v32.7,40.01
  Bottom 0.406: IC1.11 27.62,8.26 28.26,8.89 28.26,35.56 v32.7,40.01
GSM_PT
  Bottom 0.406: IC1.6 14.92,8.26 21.91,15.24 21.91,47.62 24.19,49.91 U1.11
GSM_RI
  Bottom 0.406: U1.2 48.58,50.8 47.31,49.53 35.88,49.53 24.45,38.1 24.45,12.7 20,8.26 IC1.8
GSM_RST
  Bottom 0.406: IC1.5 12.38,8.26 20.64,16.51 20.64,51.05 U1.12
LUZ  (via drill 0.5)
  Top 0.406: v91.44,8.26 91.44,2.86 90.17,1.59 77.79,1.59 76.52,2.86 U1.A13 | v91.44,11.43 91.44,16.51 | 91.44,16.51 91.44,18.31 R5.2 | U4.E 91.44,16.51
  Bottom 0.406: v91.44,8.26 v91.44,11.43
MISO  (via drill 0.5)
  Top 0.254: 6.17,42.07 U3.7
  Top 0.406: U1.50 81.91,13.97 81.28,14.61 81.28,27.94 80.65,28.57 77.79,28.57 76.52,27.3 74.61,27.3 73.98,27.94 24.45,27.94 23.18,29.21 v6.03,29.21 | 6.17,42.07 7.46,42.07 7.94,42.55 7.94,45.09 7.3,45.72 v6.03,45.72
  Bottom 0.406: v6.03,45.72 v6.03,29.21
MOSI
  Top 0.254: 21.75,35.56 IC5.5
  Top 0.305: 85.41,15.24 82.87,15.24
  Top 0.406: U1.51 85.41,15.24 | 82.87,15.24 82.23,15.88 82.23,29.21 81.6,29.84 25.72,29.84 24.45,31.11 24.45,34.93 23.81,35.56 21.75,35.56
N$1
  Top 0.813: J1.GND 38.42,35.56 MD1.5
N$2
  Top 0.406: IC12.3 41.59,67.47 40.96,68.1 40.16,68.1 39.47,68.8 C28.1 39.47,70.59 41.17,72.29 R6.2
N$3  (via drill 0.5)
  Top 0.406: C30.1 46.99,71.44 R10.2 | IC12.2 42.86,63.82 v43.18,63.5
  Bottom 0.406: v43.18,63.5 43.18,69.53 44.13,70.48 R10.2
N$4  (via drill 0.5)
  Top 0.406: 42.61,71.4 C30.2 R11.2 42.97,74.4 43.18,74.61 | IC12.6 41.59,63.18 v41.28,63.5 | R13.2 57.44,73.82 56.2,75.06 43.62,75.06 43.18,74.61 | v40.32,74.61 43.18,74.61
  Bottom 0.406: v40.32,74.61 40.32,70.48 41.28,69.53 v41.28,63.5
N$5
  Top 0.406: IC13.2 55.56,72.17 R14.1 56.1,72.07 R15.1 59.59,73.77 R13.1
N$6
  Top 0.406: R8.1 46.67,69.21 R10.3
N$7
  Top 0.406: C18.1 89.96,28.79 90.18,28.57 U2.2
N$8
  Top 0.406: R11.1 47.31,73.66 R10.1
N$9
  Top 0.813: J1.S 40.96,35.56 MD1.4
N$10
  Top 0.406: IC11.5 75.94,64.71 75.25,65.41 C29.1
N$11
  Top 0.813: J2.GND 55.56,35.56 MD2.5
N$12
  Top 0.813: J2.S 58.1,35.56 MD2.4
N$13
  Top 0.813: J3.GND 72.71,35.56 MD3.5
N$14
  Top 0.406: 30.8,13.74 C2.-
  Top 0.61: IC2.4 30.8,13.74
N$15
  Top 0.406: R7.2 C27.1 19.15,72.6 19.37,72.39 19.37,69.85 | IC10.2 18.73,69.85 19.37,69.85 | 19.37,69.85 19.94,69.85 arc90 IC10.1
N$16
  Top 0.61: C2.+ 27.39,14.69 28.26,15.56 IC2.2
N$17  (via drill 0.5)
  Top 0.406: R12.1 R9.1 17.46,62.33 IC10.6 17.46,66.67 v18.1,67.31 | 15.26,72.71 15.3,72.75 R7.1 15.26,72.71 | 15.26,72.71 v13.97,72.71
  Bottom 0.406: v13.97,72.71 16.83,72.71 18.1,71.44 v18.1,67.31
N$18
  Top 0.61: IC4.5 14.92,11.64 R4.2 15.14,10.83 14.31,10 12.07,10 11.27,10.79 11.27,11.37 R3.2
N$19
  Top 0.406: U3.5 3.71,39.91 3.17,39.37 3.17,33.02 3.81,32.38 18.1,32.38 20,34.29 IC5.6
N$20
  Top 0.406: IC5.4 20,36.83 16.83,33.66 4.76,33.66 4.13,34.29 4.13,37.15 4.69,37.71 U3.3
N$21
  Top 0.406: 6.59,36.67 U3.2 9.62,36.61 12.38,39.37 IC5.2
N$22
  Top 0.813: J3.S 75.25,35.56 MD3.4
N$24  (via drill 0.5)
  Top 0.406: IC6.12 v34.29,20.32
  Bottom 0.406: MD1.1 38.42,19.05 37.15,20.32 v34.29,20.32
N$25  (via drill 0.5)
  Top 0.406: IC6.2 v43.82,16.51
  Bottom 0.406: v43.82,16.51 42.23,16.51 40.96,15.24 MD1.2
N$26  (via drill 0.5)
  Top 0.406: v43.82,20.32 IC6.5
  Bottom 0.406: MD1.6 38.42,21.59 39.69,20.32 v43.82,20.32
N$27  (via drill 0.5)
  Top 0.406: v55.25,20.32 IC7.5
  Bottom 0.406: v55.25,20.32 55.25,32.7 MD2.6
N$28  (via drill 0.5)
  Top 0.406: IC7.2 v55.25,16.51
  Bottom 0.406: v55.25,16.51 56.83,16.51 58.1,15.24 MD2.2
N$29  (via drill 0.5)
  Top 0.406: IC7.12 v45.72,20.32
  Bottom 0.406: v45.72,20.32 53.02,20.32 54.29,19.05 54.29,11.43 MD2.1
N$30  (via drill 0.5)
  Top 0.406: IC8.12 v57.15,20.32 | v61.91,20.32 v61.91,15.88
  Bottom 0.406: MD3.1 63.18,10.16 62.55,10.79 62.55,15.24 v61.91,15.88 | v57.15,20.32 v61.91,20.32
N$31  (via drill 0.5)
  Top 0.406: IC8.2 v66.68,16.51
  Bottom 0.406: v66.68,16.51 72.71,16.51 75.25,13.97 MD3.2
N$32  (via drill 0.5)
  Top 0.406: IC8.5 v66.68,20.32
  Bottom 0.406: v66.68,20.32 66.68,31.75 67.94,33.02 MD3.6
ORP_IN
  Top 0.406: IC10.3 17.46,71.28 17.15,71.6 7.46,71.6 6.67,70.8 MD6.4
ORP_SENSOR
  Top 0.406: IC10.7 18.73,63.53 19.27,62.99 20.38,62.99 20.86,62.52 R12.2 | 20.88,61.88 R12.2 | R12.2 25.72,61.91 26.35,62.55 26.35,69.21 26.99,69.85 MD6.3
PH_IN
  Top 0.406: R6.1 39.05,73.02 37.15,71.12 MD4.4
PH_SENSOR
  Top 0.406: IC13.6 54.29,66.67 54.93,67.31 57.47,67.31 MD4.3 59.59,70.27 R15.2
RX2
  Bottom 0.406: IC1.9 22.54,8.26 25.72,11.43 25.72,37.47 36.51,48.26 65.09,48.26 66.36,49.53 U1.17
RX3  (via drill 0.5)
  Top 0.406: U1.15 61.28,49.53 62.55,48.26 v66.68,48.26
  Bottom 0.305: 82.87,35.56 87.95,35.56
  Bottom 0.406: v66.68,48.26 70.17,48.26 82.87,35.56 | 87.95,35.56 89.22,34.29 94.93,34.29 97.3,36.66 JP2.1
S1_EN  (via drill 0.5)
  Top 0.305: IC6.9 35.88,24.13 | 35.88,22.96 IC6.10 35.88,22.86
  Top 0.406: 35.88,24.13 35.88,22.96 | IC6.11 35.88,21.69 35.88,22.86 v34.29,22.86
  Bottom 0.406: U1.A5 53.66,5.08 52.39,6.35 33.97,6.35 32.7,7.62 32.7,21.59 33.97,22.86 v34.29,22.86
S1_SENSOR  (via drill 0.5)
  Top 0.406: IC3.12 v68.58,20.32
  Bottom 0.305: 59.37,11.43 59.37,8.57
  Bottom 0.406: U1.A10 68.9,5.71 68.26,6.35 61.6,6.35 59.37,8.57 44.13,8.57 43.5,9.21 MD1.3 | v68.58,20.32 68.26,20.32 66.99,19.05 60.64,19.05 59.37,17.78 59.37,11.43
S2_EN  (via drill 0.5)
  Top 0.305: IC7.9 47.31,24.13 | IC7.10 47.31,22.86
  Top 0.406: 47.31,24.13 47.31,22.86 | IC7.11 47.31,21.69 47.31,22.86 | 47.31,22.86 v45.72,22.86
  Bottom 0.305: 42.23,8.89 42.23,11.43
  Bottom 0.406: v45.72,22.86 44.77,21.91 44.77,15.24 42.23,12.7 42.23,11.43 | U1.A6 56.2,6.35 55.25,7.3 43.18,7.3 42.23,8.26 42.23,8.89
S2_SENSOR  (via drill 0.5)
  Top 0.406: IC3.13 v68.58,19.05
  Bottom 0.406: U1.A11 71.44,6.98 70.8,7.62 61.91,7.62 60.64,8.89 MD2.3 60.64,16.51 61.91,17.78 66.99,17.78 68.26,19.05 v68.58,19.05
S3_EN  (via drill 0.5)
  Top 0.305: IC8.9 58.74,24.13 | 58.74,22.96 IC8.10 58.74,22.86 | 56.83,11.43 56.83,8.89
  Top 0.406: 58.74,24.13 58.74,22.96 | 58.74,21.69 IC8.11 58.74,21.59 58.74,21.69 | 58.74,21.69 58.74,22.86 56.83,22.86 56.2,22.22 56.2,15.24 57.47,13.97 57.47,12.7 56.83,12.06 56.83,11.43 | 56.83,8.89 58.1,7.62 v58.74,7.62
  Bottom 0.406: v58.74,7.62 U1.A7
S3_SENSOR  (via drill 0.5)
  Top 0.406: IC3.14 v68.58,17.78
  Bottom 0.406: v68.58,17.78 73.34,17.78 77.79,13.33 MD3.3 77.79,8.57 73.98,4.76 U1.A12
SCK  (via drill 0.5)
  Top 0.254: 21.59,33.02 IC5.7
  Top 0.406: 21.59,33.02 22.54,33.02 23.18,32.38 23.18,30.8 25.08,28.89 75.25,28.89 v75.57,28.57 | U1.52 80.01,11.43 79.38,12.06 79.38,24.77 78.74,25.4 v75.57,25.4
  Bottom 0.406: v75.57,28.57 v75.57,25.4
SCL  (via drill 0.5)
  Top 0.406: R1.1 v91.12,46.67 91.12,46.36 91.76,45.72 94.93,45.72 97.3,48.09 JP3.1 | IC9.6 90.89,37.22 91.28,36.83 92.39,36.83 | U2.8 93.62,29.84 94.3,29.84 94.61,30.16 94.61,36.51 94.3,36.83 92.39,36.83 | v92.39,35.56 92.39,36.83
  Bottom 0.406: U1.SCL 8.95,53.72 9.84,54.61 99.38,54.61 100.65,53.34 100.65,48.9 99.84,48.09 JP3.1 | v91.12,46.67 91.12,36.83 v92.39,35.56
SDA  (via drill 0.5)
  Top 0.406: 95.57,38.26 95.57,44.45 97.2,46.09 JP3.2 | 95.57,38.26 95.57,29.21 94.92,28.57 U2.7 | 93.66,48.26 R2.1 v93.66,46.67 | IC9.1 95.46,38.37 95.57,38.26 | U1.SDA 11.49,53.72 12.38,54.61 97.47,54.61 98.74,53.34 v98.74,52.71
  Bottom 0.406: 96.2,45.72 96.2,51.44 97.47,52.71 v98.74,52.71 | v93.66,46.67 93.66,46.36 94.3,45.72 96.2,45.72 | 96.2,45.72 98.46,45.72 JP3.2
SELECT_A  (via drill 0.5)
  Top 0.406: v68.58,21.59 IC3.11
  Bottom 0.406: U1.42 82.87,24.13 80.33,21.59 v68.58,21.59
SELECT_B  (via drill 0.5)
  Top 0.406: v68.58,22.86 IC3.10
  Bottom 0.305: 82.87,25.4 85.41,25.4
  Bottom 0.406: U1.43 85.41,25.4 | v68.58,22.86 79.69,22.86 82.23,25.4 82.87,25.4
SELECT_C  (via drill 0.5)
  Top 0.406: v68.58,24.13 IC3.9 70.8,24.13
  Bottom 0.406: U1.40 81.6,26.67 79.06,24.13 v68.58,24.13
TX2  (via drill 0.5)
  Top 0.406: v66.68,44.45 67.63,44.45 68.26,45.09 68.26,48.9 67.63,49.53 65.09,49.53 63.82,50.8 U1.16
  Bottom 0.406: IC1.10 25.08,8.26 26.99,10.16 26.99,36.83 34.61,44.45 v66.68,44.45
TX3  (via drill 0.5)
  Top 0.406: v66.68,46.36 60.01,46.36 58.74,47.62 U1.14
  Bottom 0.305: 87.95,33.02 82.87,33.02
  Bottom 0.406: v66.68,46.36 69.53,46.36 82.87,33.02 | JP2.2 97.2,34.66 95.57,33.02 87.95,33.02

### Text on the board
tNames: PR+ | OUT | PR+ | OUT | PR- | V- | PR- | V- | GND | V+ | GND | V+ | SENSOR ORP | SENSOR PH | SENSOR EC | SCL | SDA | SD CARD | +5V | I2C | GND | TEMP | RX3 | /HUM | TX3 | +5V | GND | SERIAL | PRES | D44 | D45 | /HUM | +5V | PWM | GND | LUZ | A14 | A15 | 1 | 2 | 3 | +5V | FONA BOARD | GND | ANALOG
bNames: PR+ | OUT | PR+ | OUT | PR+ | OUT | PR- | V- | PR- | V- | PR- | V- | GND | V+ | GND | V+ | GND | V+ | SENSOR ORP | SENSOR PH | SENSOR EC